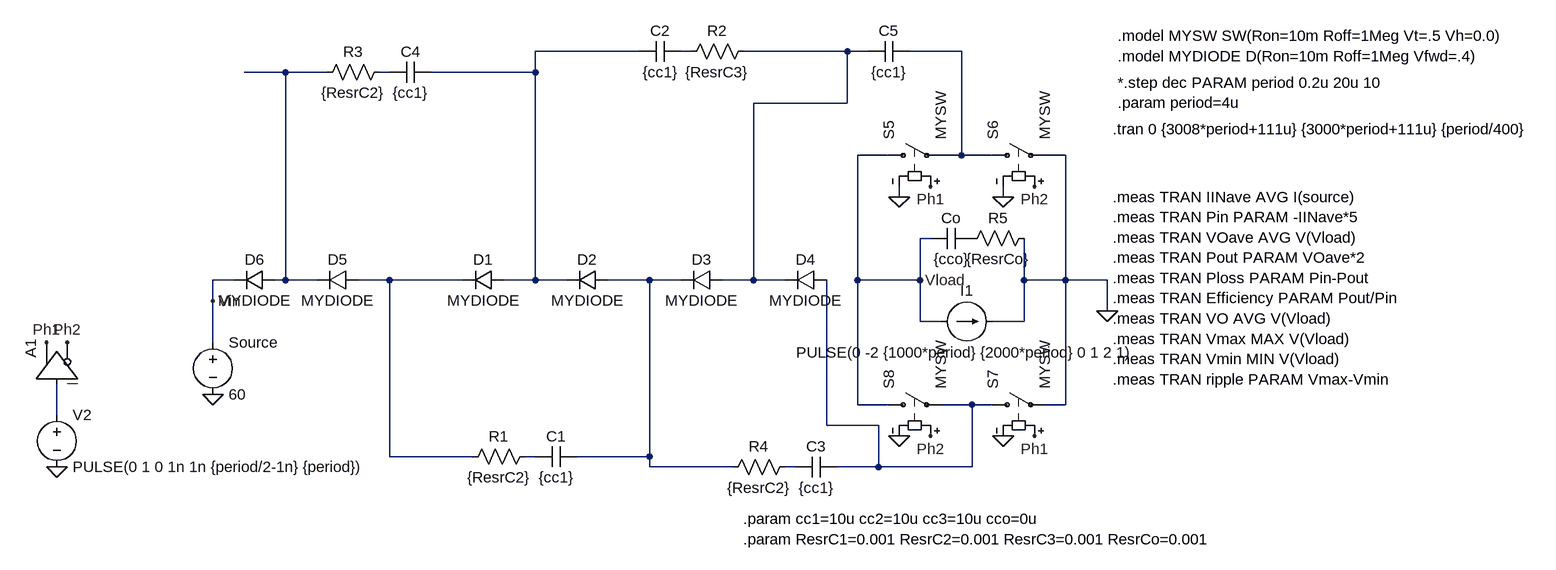
[diagram p0: schematic 1to4_CockcroftWalton_diodes.asc]
1to4_CockcroftWalton_diodes.asc, the LTspice schematic file:
Version 4
SHEET 1 1688 680
WIRE -48 -272 -208 -272
WIRE 32 -272 16 -272
WIRE 272 -272 112 -272
WIRE 304 -272 272 -272
WIRE 448 -272 368 -272
WIRE -592 -240 -656 -240
WIRE -528 -240 -592 -240
WIRE -432 -240 -448 -240
WIRE -208 -240 -208 -272
WIRE -208 -240 -368 -240
WIRE 272 -192 272 -272
WIRE 272 -192 128 -192
WIRE 336 -112 288 -112
WIRE 448 -112 448 -272
WIRE 448 -112 416 -112
WIRE 496 -112 448 -112
WIRE 608 -112 576 -112
WIRE 352 -48 352 -64
WIRE 512 -48 512 -64
WIRE 400 16 384 16
WIRE -672 80 -704 80
WIRE -592 80 -592 -240
WIRE -592 80 -608 80
WIRE -544 80 -592 80
WIRE -432 80 -480 80
WIRE -320 80 -432 80
WIRE -208 80 -208 -240
WIRE -208 80 -256 80
WIRE -160 80 -208 80
WIRE -32 80 -96 80
WIRE 16 80 -32 80
WIRE 128 80 128 -192
WIRE 128 80 80 80
WIRE 176 80 128 80
WIRE 288 80 288 -112
WIRE 384 80 384 16
WIRE 384 80 288 80
WIRE 544 80 544 16
WIRE 608 80 608 -112
WIRE 608 80 544 80
WIRE 672 80 608 80
WIRE -704 112 -704 80
WIRE 672 128 672 80
WIRE 384 144 384 80
WIRE 416 144 384 144
WIRE 544 144 544 80
WIRE 544 144 496 144
WIRE -704 176 -704 112
WIRE 288 272 288 80
WIRE 336 272 288 272
WIRE 464 272 416 272
WIRE 496 272 464 272
WIRE 608 272 608 80
WIRE 608 272 576 272
WIRE -944 288 -944 240
WIRE 240 304 240 80
WIRE 320 304 240 304
WIRE -432 352 -432 80
WIRE -304 352 -432 352
WIRE -208 352 -224 352
WIRE -32 352 -32 80
WIRE -32 352 -144 352
WIRE -32 368 -32 352
WIRE 96 368 -32 368
WIRE 192 368 176 368
WIRE 320 368 320 304
WIRE 320 368 256 368
WIRE 464 368 464 272
WIRE 464 368 320 368
FLAG -944 368 0
FLAG -960 176 Ph1
FLAG -704 256 0
FLAG 400 -64 Ph1
FLAG 560 320 Ph1
FLAG 560 -64 Ph2
FLAG 400 320 Ph2
FLAG 352 -48 0
FLAG 352 320 0
FLAG 512 -48 0
FLAG 512 320 0
FLAG 672 128 0
FLAG -704 112 Vin
FLAG 384 80 Vload
FLAG -928 176 Ph2
SYMBOL voltage -944 272 R0
WINDOW 123 0 0 Left 2
WINDOW 39 0 0 Left 2
SYMATTR InstName V2
SYMATTR Value PULSE(0 1 0 1n 1n {period/2-1n} {period})
SYMBOL Digital\\buf -1008 240 R270
SYMATTR InstName A1
SYMBOL voltage -704 160 R0
WINDOW 123 0 0 Left 2
WINDOW 39 0 0 Left 2
SYMATTR InstName Source
SYMATTR Value 60
SYMBOL sw 320 -112 R270
SYMATTR InstName S5
SYMATTR Value MYSW
SYMBOL sw 480 -112 R270
SYMATTR InstName S6
SYMATTR Value MYSW
SYMBOL sw 480 272 R270
SYMATTR InstName S7
SYMATTR Value MYSW
SYMBOL sw 320 272 R270
SYMATTR InstName S8
SYMATTR Value MYSW
SYMBOL cap 400 32 R270
WINDOW 0 32 32 VTop 2
WINDOW 3 0 32 VBottom 2
SYMATTR InstName Co
SYMATTR Value {cco}
SYMBOL res 16 -256 R270
WINDOW 0 32 56 VTop 2
WINDOW 3 0 56 VBottom 2
SYMATTR InstName R2
SYMATTR Value {ResrC3}
SYMBOL res 80 384 R270
WINDOW 0 32 56 VTop 2
WINDOW 3 0 56 VBottom 2
SYMATTR InstName R4
SYMATTR Value {ResrC2}
SYMBOL res 448 32 R270
WINDOW 0 32 56 VTop 2
WINDOW 3 0 56 VBottom 2
SYMATTR InstName R5
SYMATTR Value {ResrCo}
SYMBOL current 416 144 R270
WINDOW 0 32 40 VTop 2
WINDOW 3 -32 40 VBottom 2
WINDOW 123 0 0 Left 2
WINDOW 39 0 0 Left 2
SYMATTR InstName I1
SYMATTR Value PULSE(0 -2 {1000*period} {2000*period} 0 1 2 1)
SYMBOL diode -256 64 R90
WINDOW 0 0 32 VBottom 2
WINDOW 3 32 32 VTop 2
SYMATTR InstName D1
SYMATTR Value MYDIODE
SYMBOL diode -96 64 R90
WINDOW 0 0 32 VBottom 2
WINDOW 3 32 32 VTop 2
SYMATTR InstName D2
SYMATTR Value MYDIODE
SYMBOL diode 80 64 R90
WINDOW 0 0 32 VBottom 2
WINDOW 3 32 32 VTop 2
SYMATTR InstName D3
SYMATTR Value MYDIODE
SYMBOL diode 240 64 R90
WINDOW 0 0 32 VBottom 2
WINDOW 3 32 32 VTop 2
SYMATTR InstName D4
SYMATTR Value MYDIODE
SYMBOL cap 304 -256 R270
WINDOW 0 32 32 VTop 2
WINDOW 3 0 32 VBottom 2
SYMATTR InstName C5
SYMATTR Value {cc1}
SYMATTR SpiceLine ic=10
SYMBOL cap -48 -256 R270
WINDOW 0 32 32 VTop 2
WINDOW 3 0 32 VBottom 2
SYMATTR InstName C2
SYMATTR Value {cc1}
SYMATTR SpiceLine ic=10
SYMBOL cap 192 384 R270
WINDOW 0 32 32 VTop 2
WINDOW 3 0 32 VBottom 2
SYMATTR InstName C3
SYMATTR Value {cc1}
SYMATTR SpiceLine ic=10
SYMBOL diode -480 64 R90
WINDOW 0 0 32 VBottom 2
WINDOW 3 32 32 VTop 2
SYMATTR InstName D5
SYMATTR Value MYDIODE
SYMBOL diode -608 64 R90
WINDOW 0 0 32 VBottom 2
WINDOW 3 32 32 VTop 2
SYMATTR InstName D6
SYMATTR Value MYDIODE
SYMBOL res -320 368 R270
WINDOW 0 32 56 VTop 2
WINDOW 3 0 56 VBottom 2
SYMATTR InstName R1
SYMATTR Value {ResrC2}
SYMBOL cap -208 368 R270
WINDOW 0 32 32 VTop 2
WINDOW 3 0 32 VBottom 2
SYMATTR InstName C1
SYMATTR Value {cc1}
SYMATTR SpiceLine ic=10
SYMBOL res -544 -224 R270
WINDOW 0 32 56 VTop 2
WINDOW 3 0 56 VBottom 2
SYMATTR InstName R3
SYMATTR Value {ResrC2}
SYMBOL cap -432 -224 R270
WINDOW 0 32 32 VTop 2
WINDOW 3 0 32 VBottom 2
SYMATTR InstName C4
SYMATTR Value {cc1}
SYMATTR SpiceLine ic=10
TEXT 688 -296 Left 2 !.model MYSW SW(Ron=10m Roff=1Meg Vt=.5 Vh=0.0)\n.model MYDIODE D(Ron=10m Roff=1Meg Vfwd=.4)
TEXT 680 -48 Left 2 !.meas TRAN IINave AVG I(source)\n.meas TRAN Pin PARAM -IINave*5\n.meas TRAN VOave AVG V(Vload)\n.meas TRAN Pout PARAM VOave*2\n.meas TRAN Ploss PARAM Pin-Pout\n.meas TRAN Efficiency PARAM Pout/Pin\n.meas TRAN VO AVG V(Vload)\n.meas TRAN Vmax MAX V(Vload)\n.meas TRAN Vmin MIN V(Vload)\n.meas TRAN ripple PARAM Vmax-Vmin
TEXT 112 448 Left 2 !.param cc1=10u cc2=10u cc3=10u cco=0u\n.param ResrC1=0.001 ResrC2=0.001 ResrC3=0.001 ResrCo=0.001
TEXT 680 -152 Left 2 !.tran 0 {3008*period+111u} {3000*period+111u} {period/400}
TEXT 688 -224 Left 2 !*.step dec PARAM period 0.2u 20u 10\n.param period=4u

The netlist it stands for:
* 1to4_CockcroftWalton_diodes.asc
V2 N010 0 PULSE(0 1 0 1n 1n {period/2-1n} {period})
A1 N010 0 0 0 0 Ph2 Ph1 0 BUF
V§Source Vin 0 60
S5 Vload N004 Ph1 0 MYSW
S6 N004 0 Ph2 0 MYSW
S7 N009 0 Ph1 0 MYSW
S8 Vload N009 Ph2 0 MYSW
Co Vload P001 {cco}
R2 N002 N003 {ResrC3}
R4 N008 N012 {ResrC2}
R5 P001 0 {ResrCo}
I1 Vload 0 PULSE(0 -2 {1000*period} {2000*period} 0 1 2 1)
D1 N001 N007 MYDIODE
D2 N008 N001 MYDIODE
D3 N003 N008 MYDIODE
D4 N009 N003 MYDIODE
C5 N003 N004 {cc1} ic=10
C2 N001 N002 {cc1} ic=10
C3 N012 N009 {cc1} ic=10
D5 N007 N005 MYDIODE
D6 N005 Vin MYDIODE
R1 N007 N011 {ResrC2}
C1 N011 N008 {cc1} ic=10
R3 N005 N006 {ResrC2}
C4 N006 N001 {cc1} ic=10
.model D D
.lib standard.dio
.model MYSW SW(Ron=10m Roff=1Meg Vt=.5 Vh=0.0)
.model MYDIODE D(Ron=10m Roff=1Meg Vfwd=.4)
.meas TRAN IINave AVG I(source)
.meas TRAN Pin PARAM -IINave*5
.meas TRAN VOave AVG V(Vload)
.meas TRAN Pout PARAM VOave*2
.meas TRAN Ploss PARAM Pin-Pout
.meas TRAN Efficiency PARAM Pout/Pin
.meas TRAN VO AVG V(Vload)
.meas TRAN Vmax MAX V(Vload)
.meas TRAN Vmin MIN V(Vload)
.meas TRAN ripple PARAM Vmax-Vmin
.param cc1=10u cc2=10u cc3=10u cco=0u
.param ResrC1=0.001 ResrC2=0.001 ResrC3=0.001 ResrCo=0.001
.tran 0 {3008*period+111u} {3000*period+111u} {period/400}
*.step dec PARAM period 0.2u 20u 10
.param period=4u
.backanno
.end